# EAGLE design VL53L0X_ToF_Sensor (EAGLE 9.6.2)
COMPANY: ADAFRUIT INDUSTRIES; DRAWN: KTOWN; REV: A
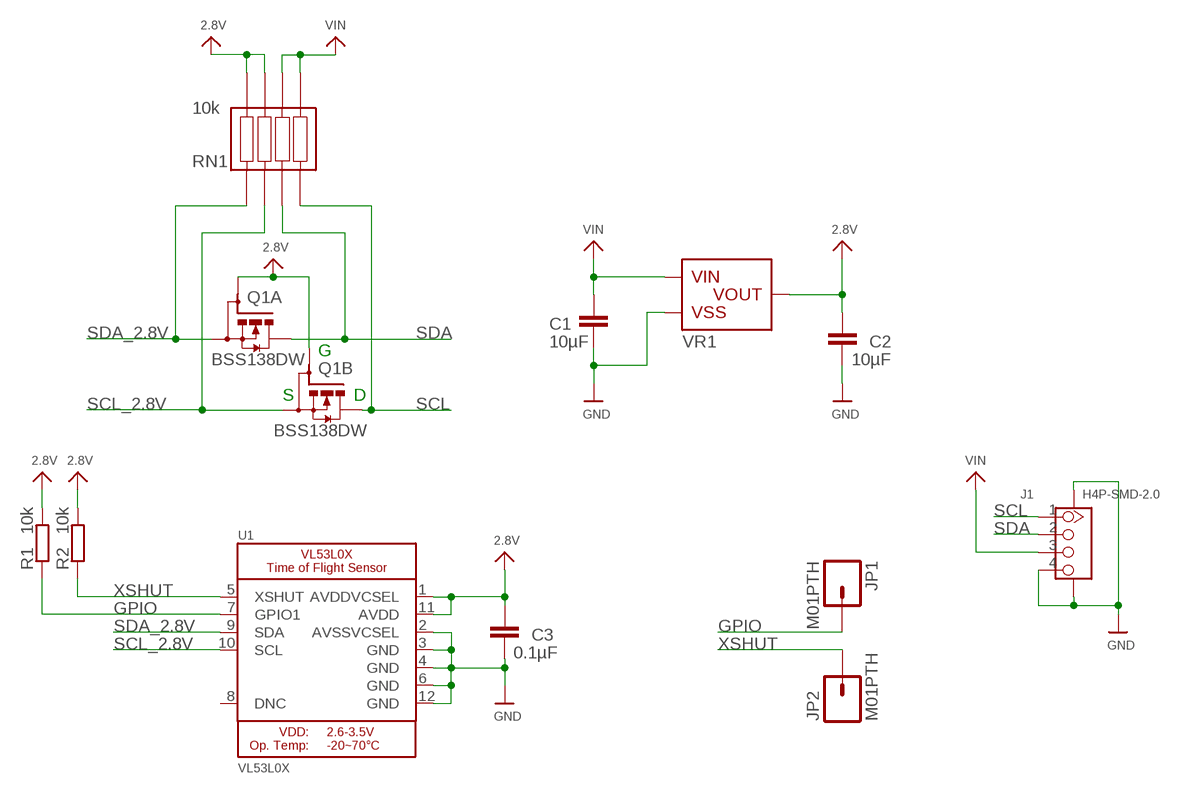
[diagram p0: schematic, sheet 1]

## Parts
C1  10µF  C-EUC0603  [C0603]
C2  10µF  C-EUC0603  [C0603]
C3  0.1µF  C-EUC0603  [C0603]
J1  H4P-SMD-2.0  GROVE-CONNECTOR-4PIN  [HW4-SMD-2.0]
JP1  M01PTH  [1X01]
JP2  M01PTH  [1X01]
Q1  BSS138DW  [SOT363]
R1  10k  R-EU_R0603  [R0603]
R2  10k  R-EU_R0603  [R0603]
RN1  10k  CAY16-221J4AS  [CAY1647R0F4LF]
U1  VL53L0X  [LGA12_ST]
VR1  UMW_XC6206SOT23-3  [SOT23-3]

## Nets
2.8V: C2.1 C3.1 Q1.2(A:G) Q1.5(B:G) R1.2 R2.2 RN1.3(R3_1) RN1.4(R4_1) U1.1(AVDDVCSEL) U1.11(AVDD) VR1.2(VOUT)
GND: C1.2 C2.2 C3.2 J1.4 J1.SS1 J1.SS2 U1.2(AVSSVCSEL) U1.3(GND) U1.4(GND) U1.6(GND) U1.12(GND) VR1.1(VSS)
GPIO: JP1.1 R1.1 U1.7(GPIO1)
SCL: J1.1 Q1.3(B:D) RN1.8(R1_2)
SCL_2.8V: Q1.4(B:S) RN1.6(R3_2) U1.10(SCL)
SDA: J1.2 Q1.6(A:D) RN1.7(R2_2)
SDA_2.8V: Q1.1(A:S) RN1.5(R4_2) U1.9(SDA)
VIN: C1.1 J1.3 RN1.1(R1_1) RN1.2(R2_1) VR1.3(VIN)
XSHUT: JP2.1 R2.1 U1.5(XSHUT)
Unconnected: U1.8(DNC)

## Notes on the sheet
- G
- S | D

## Library data of the parts
C1-C3 = ItsyBitsy_Expander_v2.0_RP2040:C-EU: CAPACITOR, European symbol; SPICEPREFIX: C
J1 = VL53L0X_ToF_Sensor:GROVE-CONNECTOR-4PIN: 320110030
JP1 JP2 = SparkFun:M01: Header 1 Standard 1-pin 0.1" header. Use with straight break away headers (SKU : PRT-00116), right angle break away headers (PRT-00553), swiss pins (PRT-00743), machine pins (PRT-00117), and female headers (PRT-00115).
Q1 = VL53L0X_ToF_Sensor:BSS138DW: NTJD5121N, Dual N−Channel with ESD Power MOSFET 60 V, 295 mA, Dual N−Channel with ESD Protection, SC−88 Source: Datasheet <http://www.farnell.com/datasheets/1708304.pdf>; MF: ON SEMICONDUCTOR; MPN: NTJD5121NT1G; OC_FARNELL: 2317611; OC_NEWARK: unknown
R1 R2 = ItsyBitsy_Expander_v2.0_RP2040:R-EU_: RESISTOR, European symbol; SPICEPREFIX: R
RN1 = VL53L0X_ToF_Sensor:CAY16-221J4AS: Resistor Networks & Arrays 220 OHMS 5% CONV 4RES Anti-Sulfur Source: Datasheet <https://www.bourns.com/docs/Product-Datasheets/CATCAY.pdf>; DESCRIPTION: Resistor Networks & Arrays 220 OHMS 5% CONV 4RES Anti-Sulfur; HEIGHT: 0.6mm; MANUFACTURER_NAME: Bourns; MANUFACTURER_PART_NUMBER: CAY16-221J4AS; MOUSER_PART_NUMBER: 652-CAY16-221J4AS; MOUSER_PRICE-STOCK: https://www.mouser.co.uk/ProductDetail/Bourns/CAY16-221J4AS?qs=5aG0NVq1C4yxlynUNdj32A%3D%3D
U1 = VL53L0X_ToF_Sensor:VL53L0X: VL53L0X - Laser Time of Flight Sensor (2M range)
VR1 = VL53L0X_ToF_Sensor:UMW_XC6206: Regulator SOT23-3 UMW XC6206

## Board
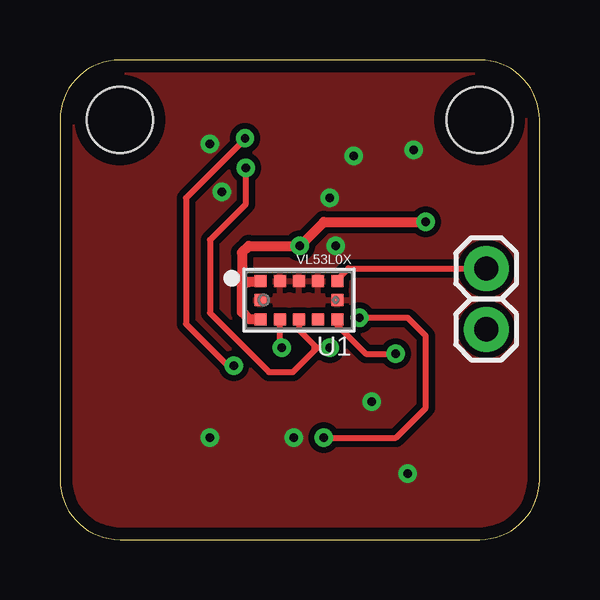
[diagram p1: board, top side]
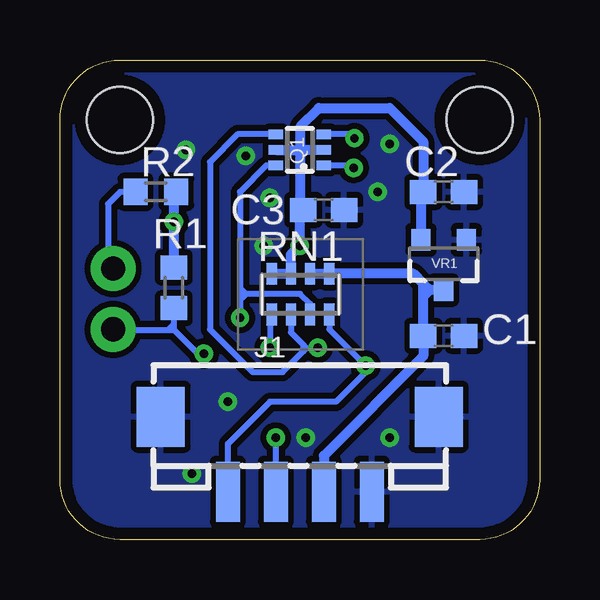
[diagram p2: board, bottom side, seen from below]

Size 20 x 20 mm. Coordinates in mm from the lower left corner, seen from the top.
Outline: 0,17.5 0,2.5 arc90 2.5,0 17.5,0 arc90 20,2.5 20,17.5 arc90 17.5,20 2.5,20 arc90 0,17.5
Copper layers (1*16): Top 0.035mm / dielectric 1.5mm / Bottom 0.035mm
Design rules "ExpanderRules": minimum track width 6mil, minimum drill 0.35mm, track to track 10mil, track to pad 10mil, pad to pad 10mil, via to via 10mil, smd to smd 10mil, copper to edge 20mil, drill to drill 15mil, minimum pad ring 10mil, minimum via ring 8mil, stop-mask expansion 4mil, vias tented up to drill 14mil, thermal gap 10mil
Holes 2.75 mm at 2.5,17.5 17.5,17.5

### Footprints (pad centres in the part's own frame; a part is rotated, then mirrored left to right if it is on the bottom)
C0603 = smd 1.1 x 1: 1 -0.85,0; 2 0.85,0
HW4-SMD-2.0 = smd 1 x 2.5: 1 -3,0; 2 -1,0; 3 1,0; 4 3,0 | smd 2 x 2.5: SS1 -5.8,3.123; SS2 5.8,3.123
1X01 = drill 1.016 pad 1.88: 1 0,0
SOT363 = smd 0.4 x 0.6: 1 -0.65,-1; 2 0,-1; 3 0.65,-1; 4 0.65,1; 5 0,1; 6 -0.65,1
R0603 = smd 1 x 1.1: 1 -0.85,0; 2 0.85,0
CAY1647R0F4LF = smd 0.425 x 0.9: 1 -1.2,-0.85; 2 -0.4,-0.85; 3 0.4,-0.85; 4 1.2,-0.85; 5 1.2,0.85; 6 0.4,0.85; 7 -0.4,0.85; 8 -1.2,0.85
LGA12_ST = smd 0.5 x 0.5: 1 1.6,-0.8; 2 0.8,-0.8; 3 0,-0.8; 4 -0.8,-0.8; 5 -1.6,-0.8; 6 -1.6,0; 7 -1.6,0.8; 8 -0.8,0.8; 9 0,0.8; 10 0.8,0.8; 11 1.6,0.8; 12 1.6,0
SOT23-3 = smd 0.8 x 0.9: 1 -0.95,-1; 2 0.95,-1; 3 0,1.1

### Placement (x,y rotation side)
C1  4,8.5 0 bottom
C2  4,14.5 0 bottom
C3  9,13.75 0 bottom
J1  10,2 0 bottom
JP1  17.78,8.76 0 top
JP2  17.78,11.3 0 top
Q1  10,16.25 90 bottom
R1  15.25,10.5 90 bottom
R2  16,14.5 0 bottom
RN1  9.97,10.24 180 bottom
U1  9.97,9.99 180 top
VR1  4,11.5 180 bottom

### Tracks (layer width: path | path; a pad name or v marks a point on that pad's centre or on a via)
2.8V  (via drill 0.35)
  Top 0.254: 7.59,11.12 7.59,11.02 7.88,10.74 7.59,10.45 7.59,10.25
  Top 0.406: U1.1 8.32,10.74 7.88,10.74 7.72,10.74 | U1.11 7.89,9.19 7.59,9.49 7.59,10.25 7.59,11.12 7.59,11.97 7.88,12.25 v10,12.25 11,13.25 v15.25,13.25
  Bottom 0.254: C3.1 9.97,13.75 | 9.97,13.99 10,13.99
  Bottom 0.406: RN1.4 RN1.3 10.37,11.88 v10,12.25 10,13.99 | Q1.5 9.97,16.25 | Q1.2 9.97,16.25 | 9.97,13.75 9.97,13.99 9.97,16.25 | 9.97,16.25 9.97,17.24 9.2,18 6.25,18 4.85,16.6 C2.1 4.95,14.4 VR1.2 | R1.2 v15.25,13.25 15.25,14.4 R2.2
GND  (via drill 0.35)
  other vias: 6.75,14.5 11.25,14.25 12.25,16 11.5,12.25 13,5.75 14.5,2.75 6.25,16.5 14.75,16.25 6.25,4.25 9.75,4.25
  pour Top: -1,21 21,21 21,-1 -1,-1
  pour Bottom: -2,22 22,22 22,-2 -2,-2
GPIO  (via drill 0.35)
  Top 0.254: U1.7 11.57,8.94 12.75,7.75 v14,7.75
  Bottom 0.254: JP1.1 17.77,8.75 15.5,8.75 | v14,7.75 14.25,7.75 15.25,8.75 | 15.25,8.75 15.25,9 | 15.25,9 R1.1 | 15.5,8.75 15.25,8.75 | 15.25,9 15.5,8.75
SCL  (via drill 0.35)
  Top 0.254: v7.72,16.74 v7.73,16.75 7.75,16.75 5.25,14.25 5.25,9 7,7.25 v7.25,7.25
  Bottom 0.254: v7.72,16.74 7.88,16.9 Q1.3 | J1.1 13,4 11.25,5.75 8.5,5.75 7.25,7 v7.25,7.25 8.77,8.77 RN1.8
SCL_2.8V  (via drill 0.35)
  Top 0.254: U1.10 9.17,8 v9.25,8
  Bottom 0.254: RN1.6 10.37,8.64 9.84,8.11 | 9.73,8 9.72,7.99 9.84,7.86 | 9.73,8 9.84,8.11 | 9.73,8 v9.25,8 | Q1.4 12.6,16.9 13.75,15.75 13.75,8.77 11.97,6.99 10.72,6.99 9.84,7.86 | 9.84,7.86 9.84,8.11
SDA  (via drill 0.35)
  Top 0.254: v11,4.25 14,4.25 15.25,5.5 15.25,8.5 14.5,9.25 v12.49,9.25
  Bottom 0.254: RN1.7 9.57,9.84 9.98,10.25 12.25,10.25 | 12.25,10.25 12.48,10.25 12.49,10.26 | 12.49,10.26 12.5,10.27 12.5,10.5 | 12.5,10.5 12.5,14.5 11.4,15.6 Q1.6 | v12.49,9.25 v12.5,9.26 12.5,10 | 12.5,10 12.5,10.25 12.49,10.26 | 12.5,10.5 12.25,10.25 | 12.25,10.25 12.5,10 | J1.2 v11,4.25
SDA_2.8V  (via drill 0.35)
  Top 0.254: U1.9 9.97,8.74 10.59,8.11 | 10.59,8.11 10.7,8 v11.25,8 | 10.59,7.86 9.72,6.99 8.72,6.99 6.25,9.45 6.25,12.5 7.75,14 v7.75,15.5 | 10.72,7.99 10.59,7.86 | 10.59,8.11 10.59,7.86
  Bottom 0.254: RN1.5 11.25,9.3 v11.25,8 | v7.75,15.5 7.85,15.6 Q1.1
VIN
  Bottom 0.406: RN1.2 RN1.1 5.27,11.09 4.84,10.66 | 4.72,8.63 C1.1 | C1.1 4.85,7.65 9,3.5 J1.3 | 4.58,10.4 4.84,10.66 | VR1.3 4.58,10.4 | C1.1 4.85,10.13 | 4.85,10.13 4.58,10.4 | 4.85,10.13 4.85,10.65 4.84,10.66
XSHUT
  Top 0.254: U1.5 11.57,10.84 12.03,11.3 JP2.1
  Bottom 0.254: R2.1 17.5,14.5 18,14 18,11.52 JP2.1